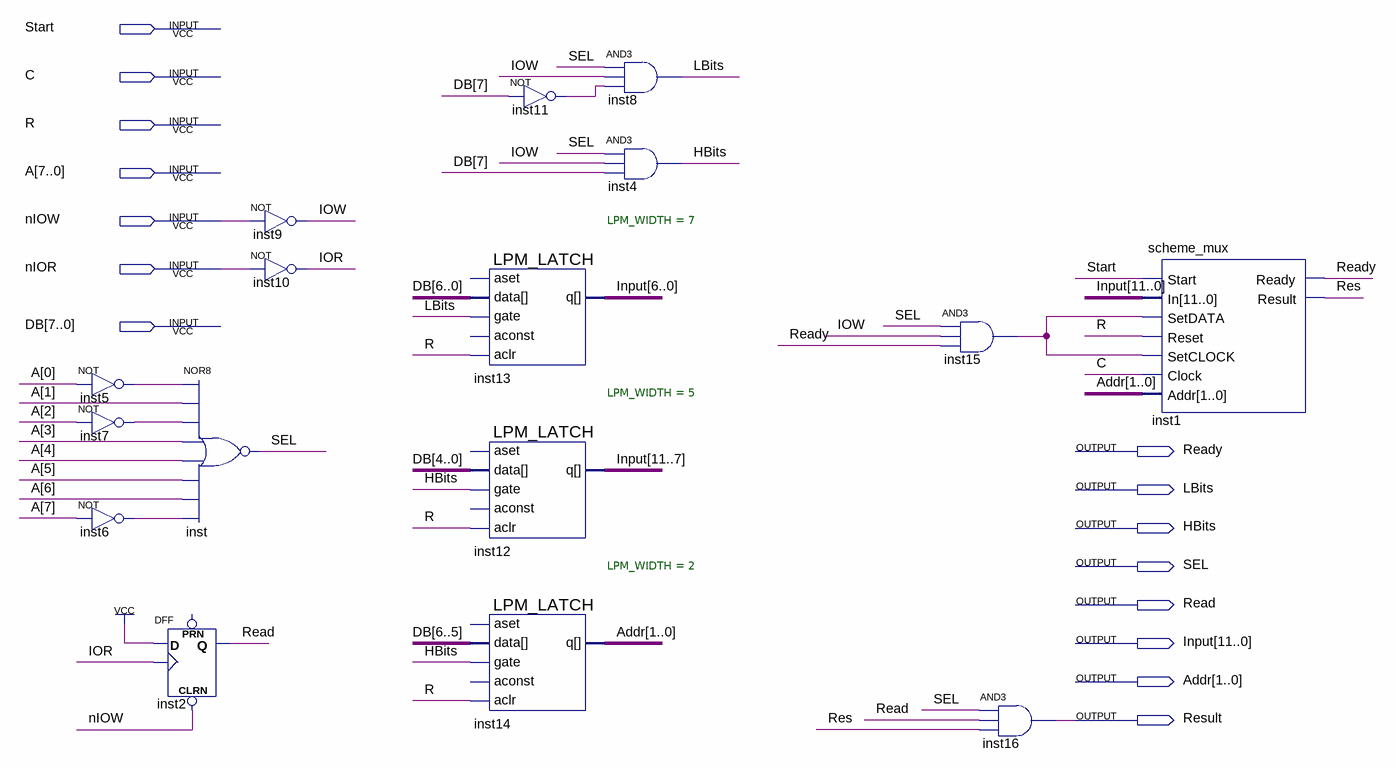
[diagram p0: schematic sheet]
// Quartus schematic inter.bdf as structural Verilog: 16 symbols, 15 pins
module inter (
  input  Start,
  input  C,
  input  R,
  input  [7:0] A,
  input  nIOW,
  input  nIOR,
  input  [7:0] DB,
  output Ready,
  output LBits,
  output HBits,
  output SEL,
  output Read,
  output [11:0] Input,
  output [1:0] Addr,
  output Result
);

  wire inst5_out, inst6_out, inst7_out, inst11_out, inst15_out, IOR, IOW, Res;

  not inst5 (inst5_out, A[0]);
  not inst7 (inst7_out, A[2]);
  not inst6 (inst6_out, A[7]);
  nor inst (SEL, inst5_out, A[1], inst7_out, A[3], A[4], A[5], A[6], inst6_out);
  DFF inst2 (.CLRN(nIOW), .CLK(IOR), .D(1'b1), .Q(Read));  // open: PRN
  not inst9 (IOW, nIOW);
  not inst10 (IOR, nIOR);
  not inst11 (inst11_out, DB[7]);
  LPM_LATCH #(.LPM_WIDTH(7)) inst13 (.aclr(R), .data(DB[6:0]), .gate(LBits), .q(Input[6:0]));  // open: aset, aconst
  LPM_LATCH #(.LPM_WIDTH(5)) inst12 (.aclr(R), .data(DB[4:0]), .gate(HBits), .q(Input[11:7]));  // open: aset, aconst
  LPM_LATCH #(.LPM_WIDTH(2)) inst14 (.aclr(R), .data(DB[6:5]), .gate(HBits), .q(Addr));  // open: aset, aconst
  and inst8 (LBits, SEL, IOW, inst11_out);
  and inst4 (HBits, SEL, IOW, DB[7]);
  and inst15 (inst15_out, SEL, IOW, Ready);
  and inst16 (Result, SEL, Read, Res);
  scheme_mux inst1 (
    .Start(Start), .In(Input), .SetDATA(inst15_out), .Reset(R), .SetCLOCK(inst15_out), .Clock(C),
    .Addr(Addr), .Ready(Ready), .Result(Res));
endmodule
